# Altium schematic sheet Sheet9.SchDoc
size A3
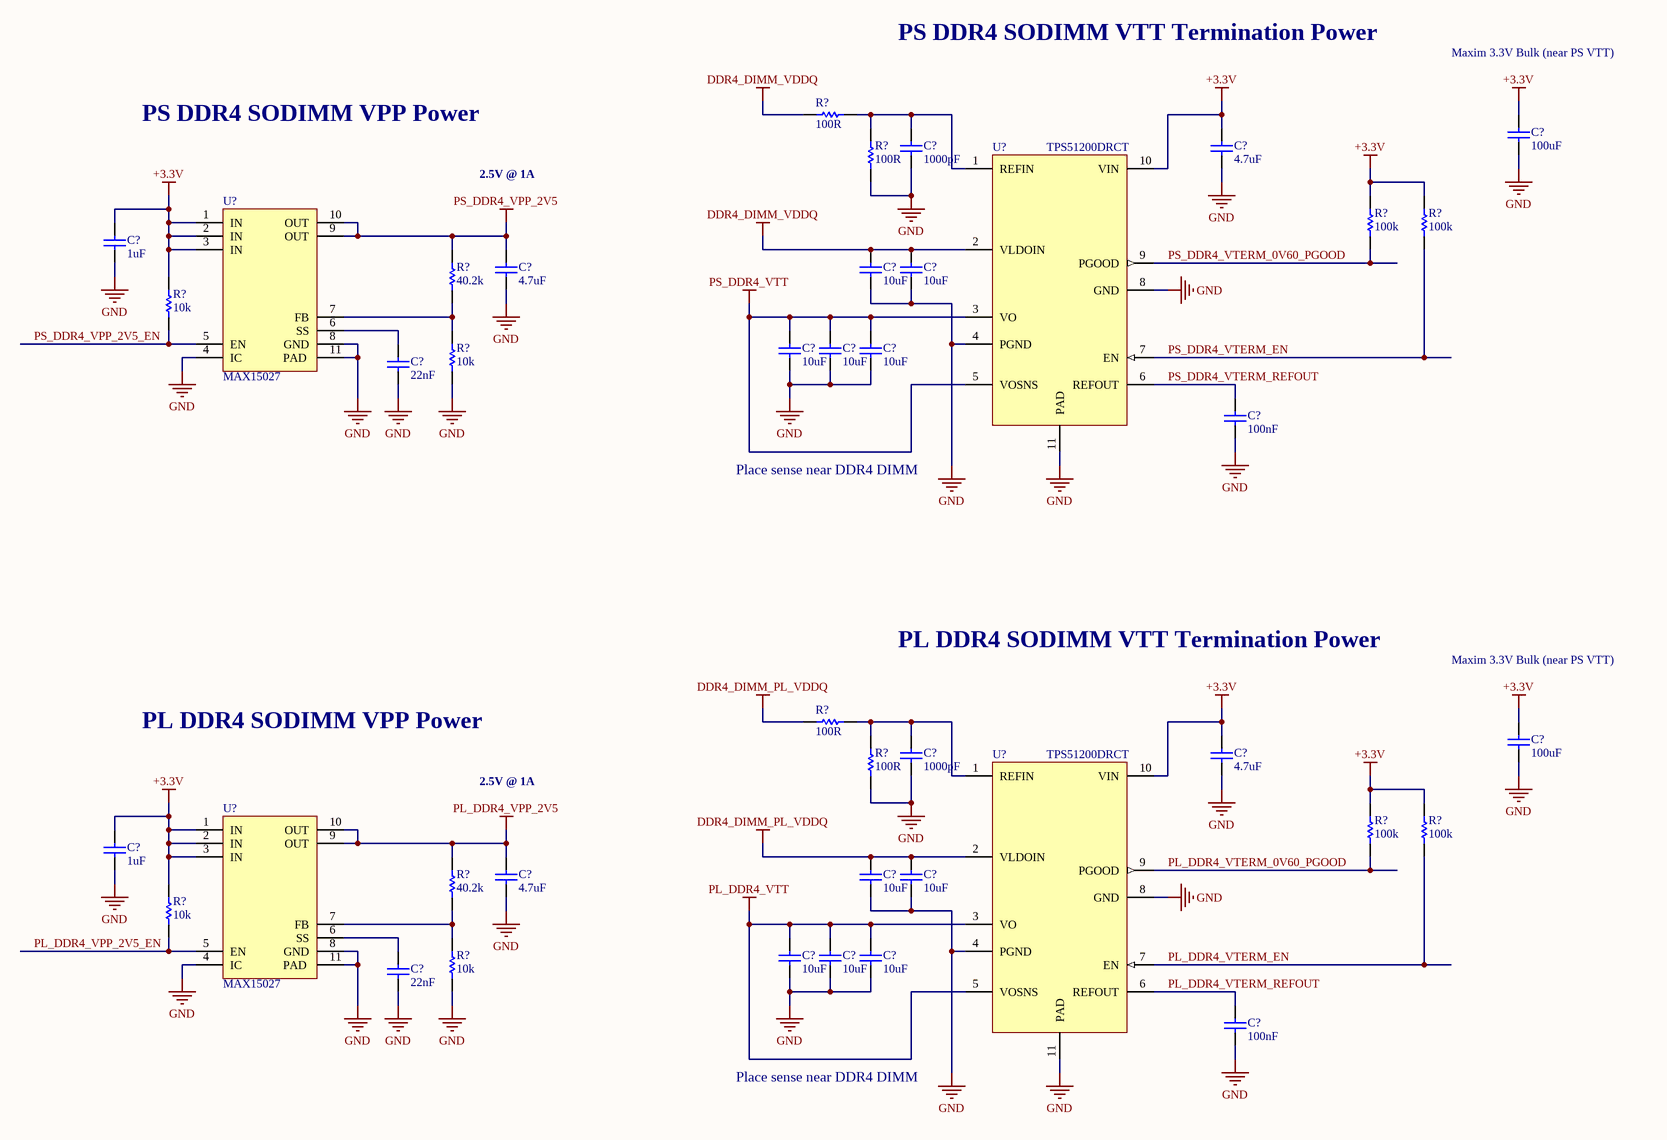
[diagram p0: Sheet9.SchDoc]

## Parts
(Parts that share a designator on the sheet are numbered #1, #2 ... from top to bottom, then left to right.)
C?#1  100uF  [CAPC3225N_1210]
C?#2  1000pF  [CAPC1005L_0402]
C?#3  4.7uF  [CAPC1005L_0402]
C?#4  1uF  [CAPC1005L_0402]
C?#5  4.7uF  [CAPC1005L_0402]
C?#6  10uF  [CAPC1005L_0402]
C?#7  10uF  [CAPC1005L_0402]
C?#8  10uF  [CAPC1005L_0402]
C?#9  10uF  [CAPC1005L_0402]
C?#10  10uF  [CAPC1005L_0402]
C?#11  22nF  [CAPC1005L_0402]
C?#12  100nF  [CAPC1005L_0402]
C?#13  100uF  [CAPC3225N_1210]
C?#14  1000pF  [CAPC1005L_0402]
C?#15  4.7uF  [CAPC1005L_0402]
C?#16  1uF  [CAPC1005L_0402]
C?#17  4.7uF  [CAPC1005L_0402]
C?#18  10uF  [CAPC1005L_0402]
C?#19  10uF  [CAPC1005L_0402]
C?#20  10uF  [CAPC1005L_0402]
C?#21  10uF  [CAPC1005L_0402]
C?#22  10uF  [CAPC1005L_0402]
C?#23  22nF  [CAPC1005L_0402]
C?#24  100nF  [CAPC1005L_0402]
R?#1  value 100R  [RESC1005L_0402]  (hidden comment: RES0402_100R_0W1_1T)
R?#2  value 100R  [RESC1005L_0402]  (hidden comment: RES0402_100R_0W1_1T)
R?#3  value 100k  [RESC1005L_0402]  (hidden comment: RES0402_100K_0W2_1T)
R?#4  value 100k  [RESC1005L_0402]  (hidden comment: RES0402_100K_0W2_1T)
R?#5  value 40.2k  [RESC1005L_0402]  (hidden comment: RES0402_40K2_0W1_1T)
R?#6  value 10k  [RESC1005L_0402]  (hidden comment: RES0402_10K_0W1_05T)
R?#7  value 10k  [RESC1005L_0402]  (hidden comment: RES0402_10K_0W1_05T)
R?#8  value 100R  [RESC1005L_0402]  (hidden comment: RES0402_100R_0W1_1T)
R?#9  value 100R  [RESC1005L_0402]  (hidden comment: RES0402_100R_0W1_1T)
R?#10  value 100k  [RESC1005L_0402]  (hidden comment: RES0402_100K_0W2_1T)
R?#11  value 100k  [RESC1005L_0402]  (hidden comment: RES0402_100K_0W2_1T)
R?#12  value 40.2k  [RESC1005L_0402]  (hidden comment: RES0402_40K2_0W1_1T)
R?#13  value 10k  [RESC1005L_0402]  (hidden comment: RES0402_10K_0W1_05T)
R?#14  value 10k  [RESC1005L_0402]  (hidden comment: RES0402_10K_0W1_05T)
U?#1  TPS51200DRCT  [DRC_S-PVSON-N10]
U?#2  MAX15027  [MAX15027_T1033+1_V]
U?#3  TPS51200DRCT  [DRC_S-PVSON-N10]
U?#4  MAX15027  [MAX15027_T1033+1_V]

## Nets
+3.3V: C?#1.2 C?#3.2 C?#4.2 C?#13.2 C?#15.2 C?#16.2 R?#3.2 R?#4.2 R?#6.2 R?#10.2 R?#11.2 R?#13.2 U?#1.10(VIN) U?#2.1(IN) U?#2.2(IN) U?#2.3(IN) U?#3.10(VIN) U?#4.1(IN) U?#4.2(IN) U?#4.3(IN)
DDR4_DIMM_PL_VDDQ: C?#18.2 C?#19.2 R?#8.2 U?#3.2(VLDOIN)
DDR4_DIMM_VDDQ: C?#6.2 C?#7.2 R?#1.2 U?#1.2(VLDOIN)
GND: C?#1.1 C?#2.1 C?#3.1 C?#4.1 C?#5.1 C?#6.1 C?#7.1 C?#8.1 C?#9.1 C?#10.1 C?#11.1 C?#12.1 C?#13.1 C?#14.1 C?#15.1 C?#16.1 C?#17.1 C?#18.1 C?#19.1 C?#20.1 C?#21.1 C?#22.1 C?#23.1 C?#24.1 R?#2.2 R?#7.1 R?#9.2 R?#14.1 U?#1.4(PGND) U?#1.8(GND) U?#1.11(PAD) U?#2.4(IC) U?#2.8(GND) U?#2.11(PAD) U?#3.4(PGND) U?#3.8(GND) U?#3.11(PAD) U?#4.4(IC) U?#4.8(GND) U?#4.11(PAD)
PL_DDR4_VPP_2V5: C?#17.2 R?#12.2 U?#4.9(OUT) U?#4.10(OUT)
PL_DDR4_VTT: C?#20.2 C?#21.2 C?#22.2 U?#3.3(VO) U?#3.5(VOSNS)
PS_DDR4_VPP_2V5: C?#5.2 R?#5.2 U?#2.9(OUT) U?#2.10(OUT)
PS_DDR4_VTT: C?#8.2 C?#9.2 C?#10.2 U?#1.3(VO) U?#1.5(VOSNS)
PL_DDR4_VPP_2V5_EN: R?#13.1 U?#4.5(EN)
PL_DDR4_VTERM_0V60_PGOOD: R?#10.1 U?#3.9(PGOOD)
PL_DDR4_VTERM_EN: R?#11.1 U?#3.7(EN)
PL_DDR4_VTERM_REFOUT: C?#24.2 U?#3.6(REFOUT)
PS_DDR4_VPP_2V5_EN: R?#6.1 U?#2.5(EN)
PS_DDR4_VTERM_0V60_PGOOD: R?#3.1 U?#1.9(PGOOD)
PS_DDR4_VTERM_EN: R?#4.1 U?#1.7(EN)
PS_DDR4_VTERM_REFOUT: C?#12.2 U?#1.6(REFOUT)
NetC?#2_2: C?#2.2 R?#1.1 R?#2.1 U?#1.1(REFIN)
NetC?#11_2: C?#11.2 U?#2.6(SS)
NetC?#14_2: C?#14.2 R?#8.1 R?#9.1 U?#3.1(REFIN)
NetC?#23_2: C?#23.2 U?#4.6(SS)
NetR?#5_1: R?#5.1 R?#7.2 U?#2.7(FB)
NetR?#12_1: R?#12.1 R?#14.2 U?#4.7(FB)

## Notes on the sheet
- PS DDR4 SODIMM VTT Termination Power
- Maxim 3.3V Bulk (near PS VTT)
- PS DDR4 SODIMM VPP Power
- 2.5V @ 1A
- Place sense near DDR4 DIMM
- PL DDR4 SODIMM VTT Termination Power
- PL DDR4 SODIMM VPP Power

## Library data of the parts
C?#1 C?#13 = CAPCER1210X5R100U16V_20T: CAP CER 100UF 16V X5R 1210; Manufacturer 1: Taiyo Yuden; Manufacturer Part Number 1: EMK325ABJ107MM-T; Tolerance: 20%; Package: 1210; ComponentLink1Description: Datasheet; Value: 100uF; Voltage: 16V; Temperature Coefficient: X5R; Supplier 1: Digi-Key; Supplier Part Number 1: 587-3152-1-ND; Operating Temperature: -55°C ~ 85°C
C?#2 C?#14 = CAPCER0402X7R1000P50V_10T: CAP CER 1000PF 50V X7R 0402; Manufacturer 1: Murata Electronics North America; Manufacturer Part Number 1: GRM155R71H102KA01D; Tolerance: 10%; Package: 0402; ComponentLink1Description: Datasheet; Value: 1000pF; Voltage: 50V; Temperature Coefficient: X7R; Supplier 1: Digi-Key; Supplier Part Number 1: 490-1303-1-ND; Operating Temperature: -55°C ~ 125°C
C?#3 C?#5 C?#15 C?#17 = CAPCER0402X5R4U710V_10T: CAP CER 4.7UF 10V X5R 0402; Manufacturer 1: TDK Corporation; Manufacturer Part Number 1: C1005X5R1A475K050BC; Tolerance: 10%; Package: 0402; ComponentLink1Description: Datasheet; Value: 4.7uF; Voltage: 10V; Temperature Coefficient: x5R; Supplier 1: Digi-Key; Supplier Part Number 1: 445-13820-1-ND; Operating Temperature: -55°C ~ 85°C
C?#4 C?#16 = CAPCER0402X5R1U16V_20T: CAP CER 1UF 16V X5R 0402; Manufacturer 1: Murata Electronics North America; Manufacturer Part Number 1: GRM155R61C105ME01D; Tolerance: 20%; Package: 0402; ComponentLink1Description: Datasheet; Value: 1uF; Voltage: 16V; Temperature Coefficient: X5R; Supplier 1: Digi-Key; Supplier Part Number 1: 490-10454-1-ND; Operating Temperature: -55°C ~ 85°C
C?#6-C?#10 C?#18-C?#22 = CAPCER0402X5R10U10V_20T: CAP CER 10UF 10V X5R 0402; Manufacturer 1: Samsung Electro-Mechanics America, Inc.; Manufacturer Part Number 1: CL05A106MP5NUNC; Tolerance: 20%; Package: 0402; ComponentLink1Description: Datasheet; Value: 10uF; Voltage: 10V; Temperature Coefficient: X5R; Supplier 1: Digi-Key; Supplier Part Number 1: 1276-1450-1-ND; Operating Temperature: -55°C ~ 85°C
C?#11 C?#23 = CAPCER0402X7R22N50V_10T: CAP CER 0.022UF 50V X7R 0402; Manufacturer 1: Murata Electronics North America; Manufacturer Part Number 1: GRM155R71H223KA12D; Tolerance: 10%; Package: 0402; ComponentLink1Description: Datasheet; Value: 22nF; Voltage: 50V; Temperature Coefficient: X7R; Supplier 1: Digi-Key; Supplier Part Number 1: 490-3884-1-ND; Operating Temperature: -55°C ~ 125°C
C?#12 C?#24 = CAPCER0402X7R100N25V_10T: CAP CER 0.1UF 25V X7R 0402; Manufacturer 1: Murata Electronics North America; Manufacturer Part Number 1: GRM155R71E104KE14D; Tolerance: 10%; Package: 0402; ComponentLink1Description: Datasheet; Value: 100nF; Voltage: 25V; Temperature Coefficient: X7R; Supplier 1: Digi-Key; Supplier Part Number 1: 490-10698-1-ND; Operating Temperature: -55°C ~ 125°C
R?#1 R?#2 R?#8 R?#9 = RES0402_100R_0W1_1T: RES SMD 100 OHM 1% 1/10W 0402; Manufacturer 1: Panasonic Electronic Components; Manufacturer Part Number 1: ERJ-2RKF1000X; Package: 0402; ComponentLink1Description: Datasheet; Power: 1/10W; Tolerance: 1%; Supplier 1: Digi-Key; Supplier Part Number 1: P100LCT-ND
R?#3 R?#4 R?#10 R?#11 = RES0402_100K_0W2_1T: RES SMD 100K OHM 1% 1/5W 0402; Manufacturer 1: Vishay Dale; Manufacturer Part Number 1: RCS0402100KFKED; Package: 0402; ComponentLink1Description: Datasheet; Power: 1/5W; Tolerance: 1%; Supplier 1: Digi-Key; Supplier Part Number 1: 541-2899-1-ND
R?#5 R?#12 = RES0402_40K2_0W1_1T: RES SMD 40.2K OHM 1% 1/10W 0402; Manufacturer 1: Panasonic Electronic Components; Manufacturer Part Number 1: ERJ-2RKF4022X; Package: 0402; ComponentLink1Description: Datasheet; Power: 1/10W; Tolerance: 1%; Supplier 1: Digi-Key; Supplier Part Number 1: P40.2KLCT-ND
R?#6 R?#7 R?#13 R?#14 = RES0402_10K_0W1_05T: RES SMD 10K OHM 0.5% 1/16W 0402; Manufacturer 1: Panasonic Electronic Components; Manufacturer Part Number 1: ERJ-2RHD1002X; Package: 0402; ComponentLink1Description: Datasheet; Power: 1/16W; Tolerance: 0.5%; Supplier 1: Digi-Key; Supplier Part Number 1: P15984CT-ND
U?#1 U?#3 = TPS51200DRCT: IC SINK/SOURCE DDR REG 10-SON; Manufacturer 1: Texas Instruments; ComponentLink1Description: Datasheet; ComponentLink1URL: C:\Users\Public\Documents\Altium\AD16\Library\PDF\tps51200.pdf; Supplier 1: Digi-Key; Supplier Part Number 1: 296-23830-1-ND; Manufacturer Part Number 1: TPS51200DRCT; Operating Temperature: -40°C ~ 85°C
U?#2 U?#4 = MAX15027: IC REG LINEAR POS ADJ 1A 10TDFN; Manufacturer 1: Maxim Integrated; Manufacturer Part Number 1: MAX15027ATB+T; ComponentLink1Description: Datasheet; ComponentLink1URL: C:\Users\Public\Documents\Altium\AD16\Library\PDF\MAX15027-MAX15028.pdf; Supplier 1: Digi-Key; Supplier Part Number 1: MAX15027ATB+TCT-ND; Operating Temperature: -40°C ~ 125°C